# Altium schematic sheet SCH_Power_Jack.SchDoc
size A4; SheetNumber: 1; SheetTotal: 1
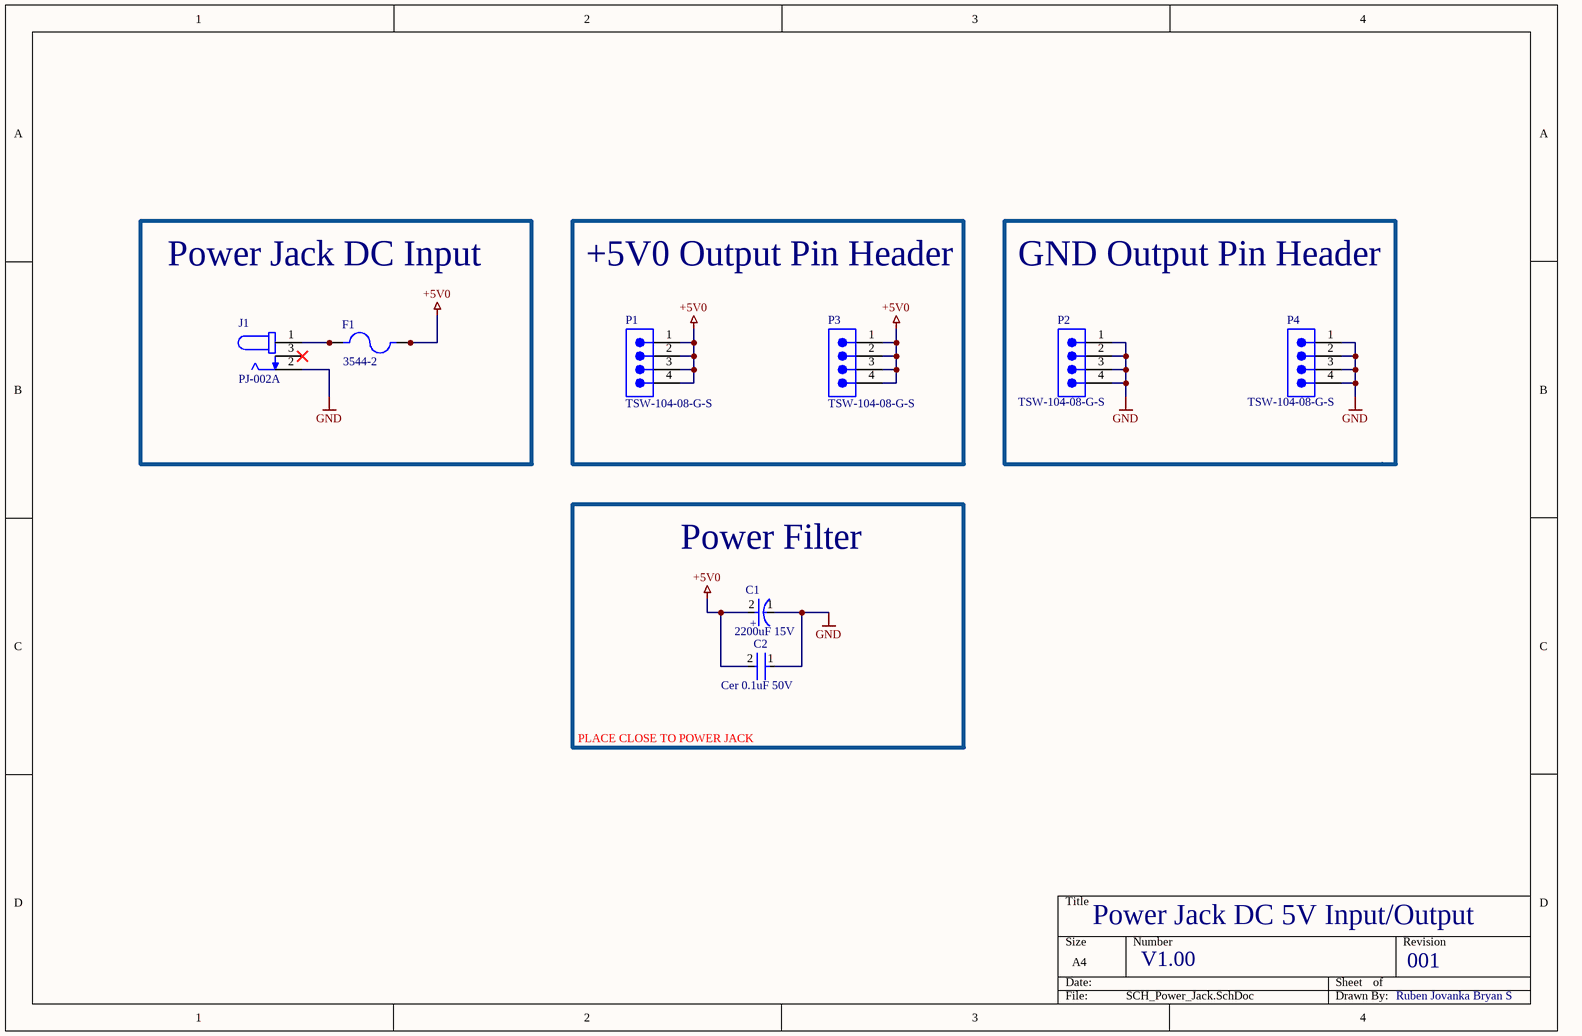
[diagram p0: SCH_Power_Jack.SchDoc]

## Parts
C1  2200uF 15V  [FP-RAD-TH-D_18_0_5-L_25_2-MFG]
C2  Cer 0.1uF 50V  [FP-K15H5-MFG]
F1  3544-2  [FUSE_3544-2]
J1  PJ-002A  [CUI_PJ-002A]
P1  TSW-104-08-G-S  [SMTC-TSW-104-08-X-S]
P2  TSW-104-08-G-S  [SMTC-TSW-104-08-X-S]
P3  TSW-104-08-G-S  [SMTC-TSW-104-08-X-S]
P4  TSW-104-08-G-S  [SMTC-TSW-104-08-X-S]

## Blocks framed on the sheet
Power Jack DC Input: F1 J1
+5V0 Output Pin Header: P1 P3
Power Filter: C1 C2

## Nets
+5V0: C1.2(A) C2.2 F1.2_1 F1.2_2 P1.1 P1.2 P1.3 P1.4 P3.1 P3.2 P3.3 P3.4
GND: C1.1(C) C2.1 J1.2 P2.1 P2.2 P2.3 P2.4 P4.1 P4.2 P4.3 P4.4
NetF1_1_1: F1.1_1 F1.1_2 J1.1

Not connected (* = marked no-connect by the designer): J1 3*

## Notes on the sheet
- GND Output Pin Header
- PLACE CLOSE TO POWER JACK
- Power Jack DC 5V Input/Output
- V1.00
- 001
- Ruben Jovanka Bryan S
- (in symbol CMP-05427-000163-1) +

## Library data of the parts
C1 = CMP-05427-000163-1: Aluminum Electrolytic Capacitors (Radial Lead Type) AEC-Q200 Qualified 3300uF ±20% 35V; Lead Diameter: 0.8mm; Capacitance: 3.3mF; Ripple Current: 2.85A; Life (Hours): 5000Hour; Dielectric Material: Aluminium; Termination: Radial; Length: 25mm; Max Operating Temperature: 105°C; Number of Pins: 2; Voltage Rating: 35V; RoHS Compliant: Yes; REACH SVHC: No SVHC; Series: FK; Min Operating Temperature: -55°C; Voltage: 35V; Voltage Rating (DC): 35V; Packaging: Bulk; Height: 25mm; Lead Pitch: 7.5mm; Case/Package: Radial; Diameter: 18mm; Package Quantity: 50; Radiation Hardening: No; Construction: RADIAL; Tolerance: 20%; Mount: Through Hole
C2 = CMP-02417-000078-1: CAP CER 0.1UF 50V X7R RADIAL; Capacitance: 100nF; Tolerance: 10%; Dielectric Material: Ceramic; Lead Length: 30mm; Lead Diameter: 0.5mm; Lead/Base Style: Formed Leads; Diameter: 500um; Max Operating Temperature: 125°C; Case/Package: Dipped; Dielectric: X7R; Lead Free: Lead Free; Construction: RADIAL; Voltage: 50V; Thickness: 2.6mm; Min Operating Temperature: -55°C; Lead Pitch: 5mm; Height: 4mm; Radiation Hardening: No; Voltage Rating: 50V; Depth: 2.5mm; Voltage Rating (DC): 50V; Package Quantity: 1; Weight: 0.005644oz; Series: K; Mount: Through Hole; Termination: Radial; Height - Seated (Max): 0.257inch; Length: 4mm; Packaging: Tape and Reel; Width: 2.5mm; RoHS Compliant: Yes
F1 = 3544-2: Fuse Clip, 500 VAC, 30 A, PCB, For 0.110 in. x 0.032 in. mini blade fuses | Keystone Electronics 3544-2; SnapEDA_Link: https://www.snapeda.com/parts/3544-2/Keystone/view-part/?ref=snap; Package: None; Value: *; MF: Keystone Electronics; MP: 3544-2; Check_prices: https://www.snapeda.com/parts/3544-2/Keystone/view-part/?ref=eda
J1 = PJ-002A: 2.0 x 6.5 mm, 2.5 A, Horizontal, Through Hole, Dc Power Jack Connector; MF: Same Sky; SnapEDA_Link: https://www.snapeda.com/parts/PJ-002A/Same+Sky/view-part/?ref=snap; Package: None; Value: *; MP: PJ-002A; Check_prices: https://www.snapeda.com/parts/PJ-002A/Same+Sky/view-part/?ref=eda
P1-P4 = CMP-1024-00357-1: 0.025" SQ Post Header, Through-hole, Vertical, -55 to 125 degC, 2.54 mm Pitch, 4-Pin, Male, RoHS; Manufacturer: Samtec; Pitch: 2.54 mm; RoHS: True; ComponentLink3URL: http://www.samtec.com/documents/webfiles/cpdf/TSW-XXX-XX-XXX-X-XX-XXX-MKT.pdf; Mounting Technology: Through-hole; ComponentLink2URL: http://www.samtec.com/documents/webfiles/pdf/TSW_TH.PDF; ComponentLink1URL: http://www.samtec.com; ComponentLink3Description: Package Specification; PackageVersion: DM, 8/1988; ComponentLink2Description: Datasheet; PackageReference: TSW-104-08-X-S; PackageDescription: .025[0.64] SQ. Post Terminal Strip Assembly; PartNumber: TSW-104-08-G-S; ComponentLink1Description: Manufacturer URL; Temperature Range: -55 to 125 degC; DatasheetVersion: F-214; Orientation: Vertical